# EasyEDA schematic 麦轮小车.json
TITLE: 麦轮小车; REV: 1.0; Date: 2022-09-26; Sheet: 1/1; Drawn By: Saw123; Company: Your Company
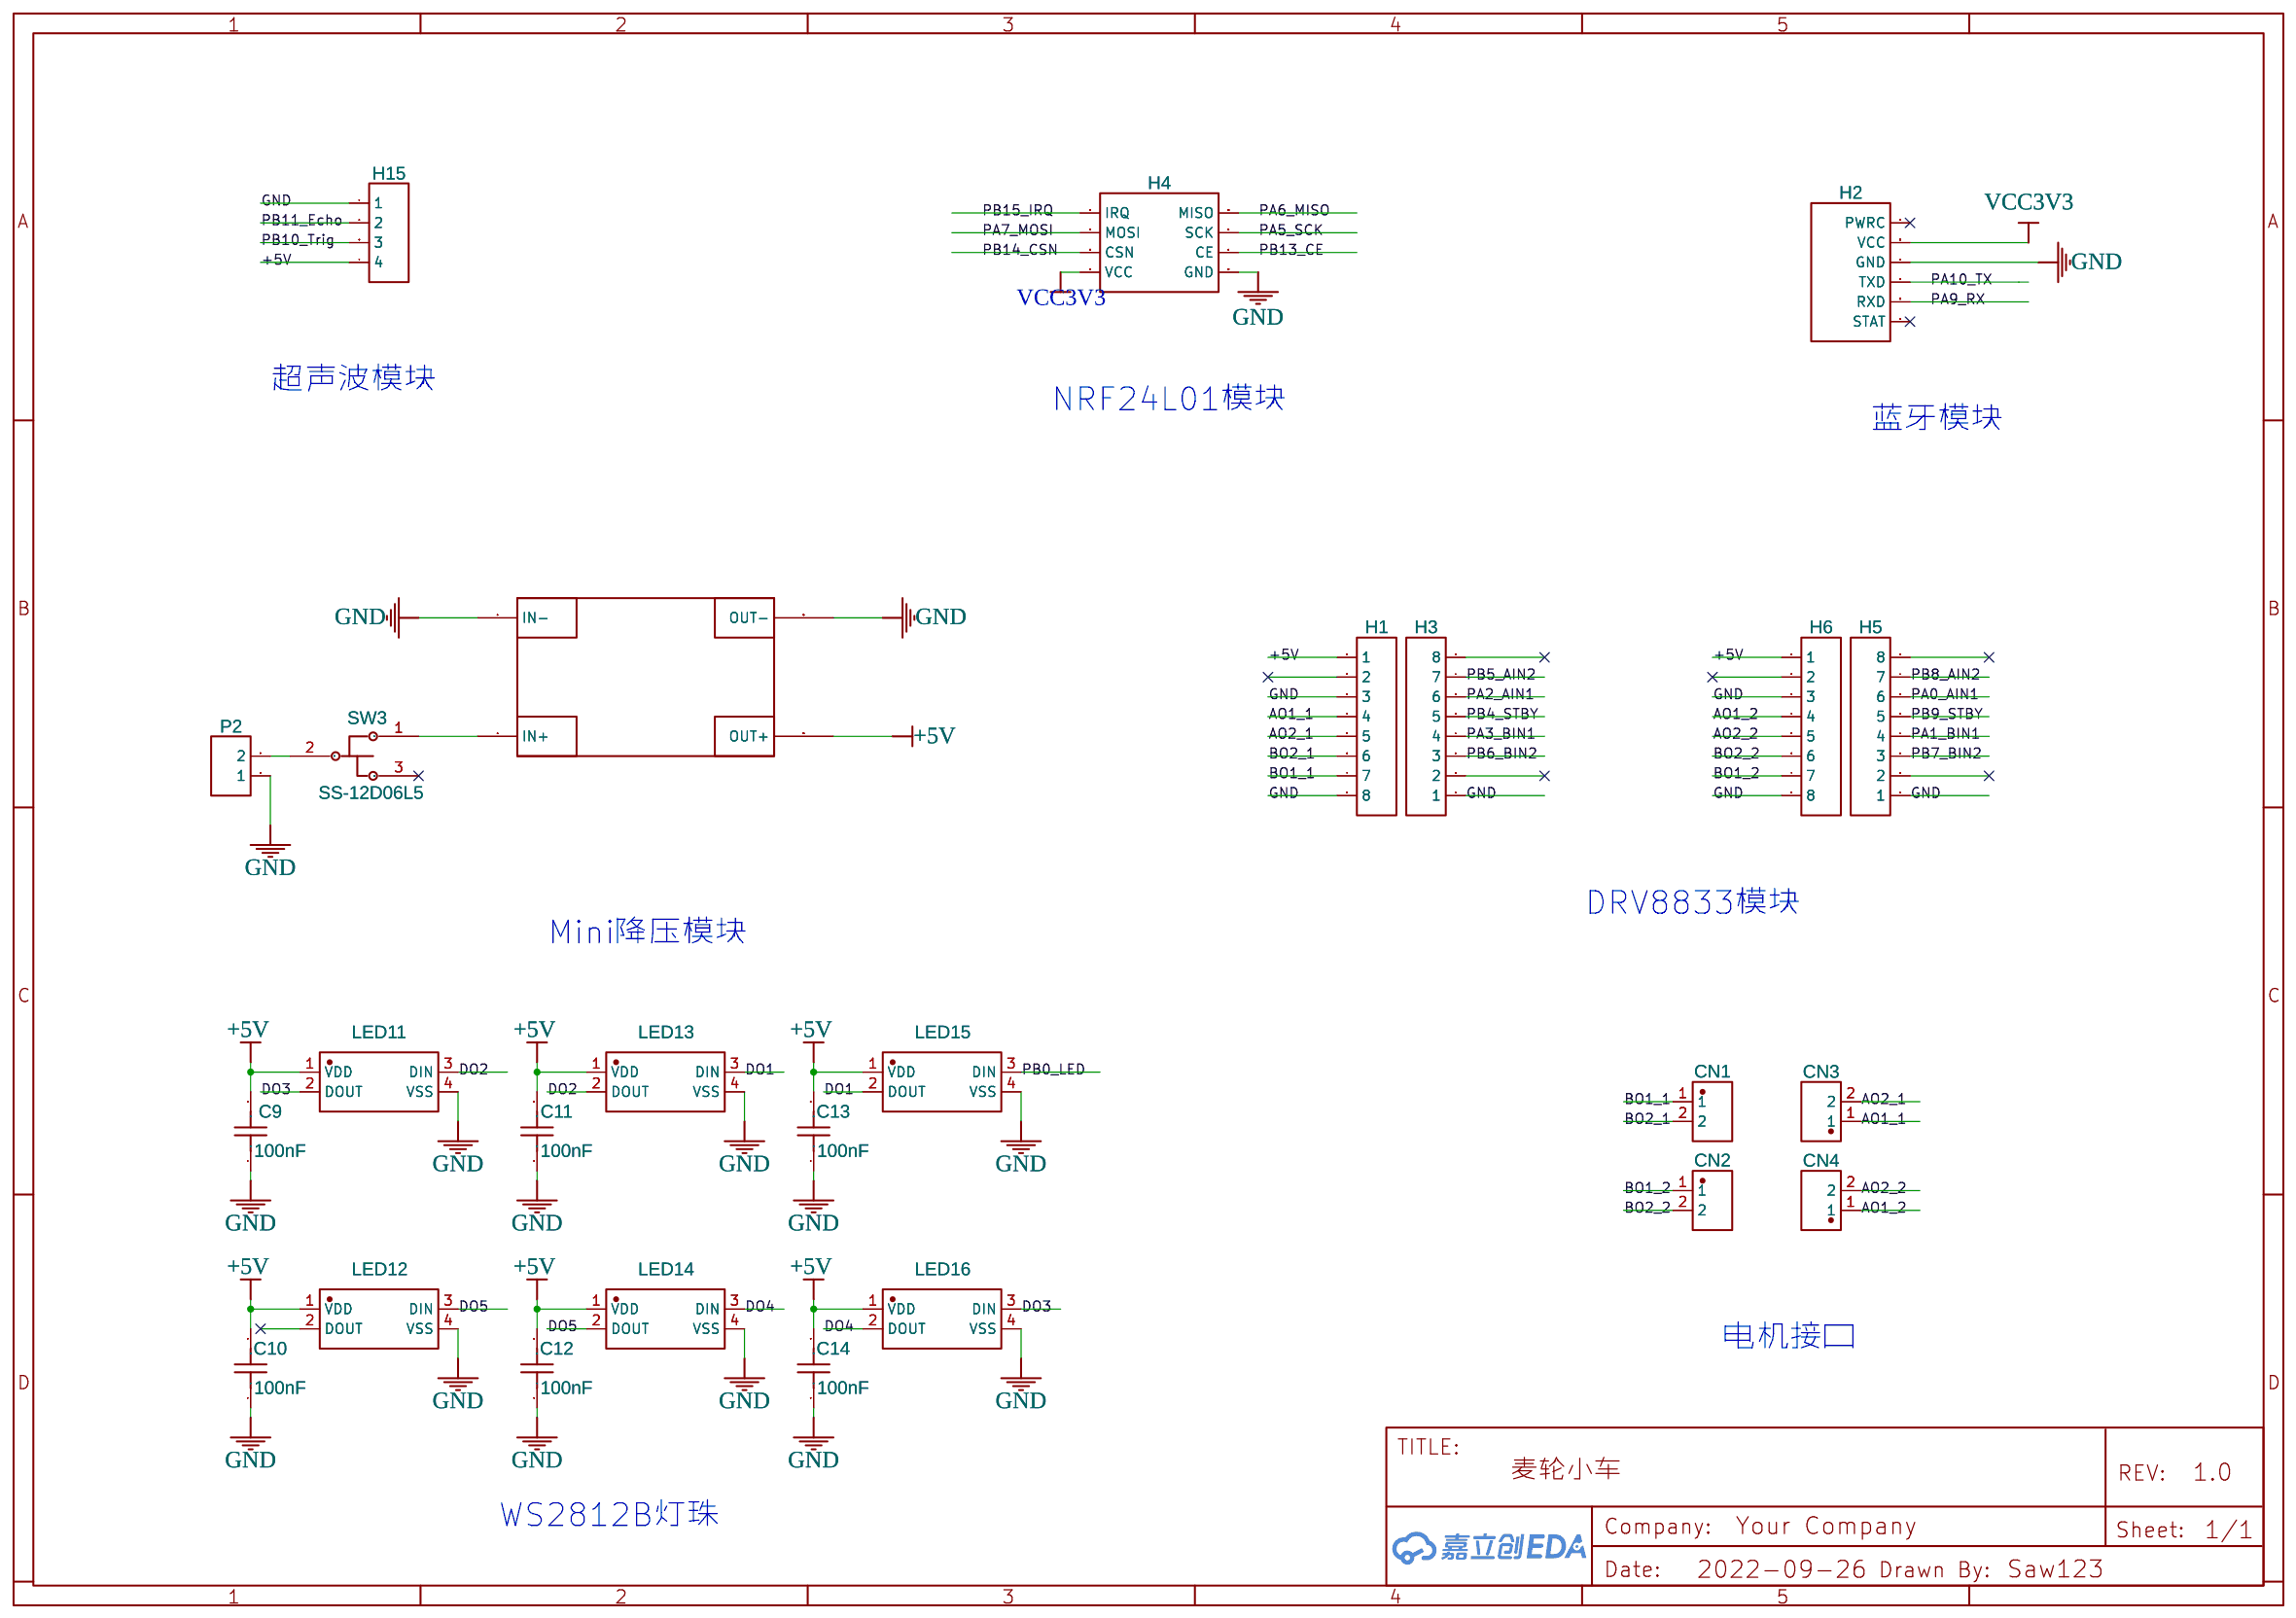
[diagram p0: schematic sheet]

## Parts
C9  100nF  [C0805]
C10  100nF  [C0805]
C11  100nF  [C0805]
C12  100nF  [C0805]
C13  100nF  [C0805]
C14  100nF  [C0805]
CN1  HX25035-2A  [CONN-TH_P2.50_HX25035-2A]
CN2  HX25035-2A  [CONN-TH_P2.50_HX25035-2A]
CN3  HX25035-2A  [CONN-TH_P2.50_HX25035-2A]
CN4  HX25035-2A  [CONN-TH_P2.50_HX25035-2A]
H1  HDR-F-2.54_1x8  [HDR-F-2.54_1X8]
H2  JDY-23蓝牙模块  [JDY-23蓝牙模块]
H3  HDR-F-2.54_1x8  [HDR-F-2.54_1X8]
H4  NRF24L01无线模块  [NRF24L01无线模块]
H5  HDR-F-2.54_1x8  [HDR-F-2.54_1X8]
H6  HDR-F-2.54_1x8  [HDR-F-2.54_1X8]
H15  HDR-F-2.54_1x4  [HDR-F-2.54_1X4]
LED11  WS2812B-V5/W  [LED-SMD_L5.0-W5.0-P3.20-LS5.4-TL]
LED12  WS2812B-V5/W  [LED-SMD_L5.0-W5.0-P3.20-LS5.4-TL]
LED13  WS2812B-V5/W  [LED-SMD_L5.0-W5.0-P3.20-LS5.4-TL]
LED14  WS2812B-V5/W  [LED-SMD_L5.0-W5.0-P3.20-LS5.4-TL]
LED15  WS2812B-V5/W  [LED-SMD_L5.0-W5.0-P3.20-LS5.4-TL]
LED16  WS2812B-V5/W  [LED-SMD_L5.0-W5.0-P3.20-LS5.4-TL]
P2  CONN-TH_2P-P5.00  [CONN-TH_2P-P5.00]
SW3  SS-12D06L5  [SS-12D06]
U2  Mini降压模块  [MINI降压模块]

## Library data of the parts
C9-C14 = C_0805_US: Contributor: LCEDA_Lib
CN1-CN4 = HX25035-2A: Supplier: LCSC; Supplier Part: C442378; Manufacturer: HX(红星); Contributor: LCSC; JLCPCB Part Class: Extended Part
H1 H3 H5 H6 = HDR-F-2.54_1x8: Supplier Part: C225505; Supplier: LCSC; Contributor: LCEDA_Lib
H2 = JDY-23蓝牙模块: Contributor: saw123
H4 = NRF24L01无线模块: Contributor: saw123
H15 = HDR-F-2.54_1x4: Supplier Part: C225501; Supplier: LCSC; Contributor: LCEDA_Lib
LED11-LED16 = WS2812B-V5/W: Supplier: LCSC; Supplier Part: C2874885; Manufacturer: worldsemi; JLCPCB Part Class: Extended Part; Contributor: lcsc
P2 = CONN-TH_2P-P5.00: Supplier: LCSC; Contributor: LCEDA_Lib
SW3 = SS-12D06L5: Supplier: LCSC; Supplier Part: C319015; Manufacturer: XKB Enterprise; Contributor: 酷电玩家
U2 = Mini降压模块: Contributor: Saw123

## Nets
+5V: C9.2 C10.2 C11.2 C12.2 C13.2 C14.2 H1.1 H6.1 H15.4 LED11.1(VDD) LED12.1(VDD) LED13.1(VDD) LED14.1(VDD) LED15.1(VDD) LED16.1(VDD) U2.OUT+
GND: C9.1 C10.1 C11.1 C12.1 C13.1 C14.1 H1.3 H1.8 H2.GND H3.1 H4.GND H5.1 H6.3 H6.8 H15.1 LED11.4(VSS) LED12.4(VSS) LED13.4(VSS) LED14.4(VSS) LED15.4(VSS) LED16.4(VSS) P2.1 U2.IN- U2.OUT-
VCC3V3: H2.VCC H4.VCC
AO1_1: CN3.1 H1.4
AO1_2: CN4.1 H6.4
AO2_1: CN3.2 H1.5
AO2_2: CN4.2 H6.5
BO1_1: CN1.1 H1.7
BO1_2: CN2.1 H6.7
BO2_1: CN1.2 H1.6
BO2_2: CN2.2 H6.6
DO1: LED13.3(DIN) LED15.2(DOUT)
DO2: LED11.3(DIN) LED13.2(DOUT)
DO3: LED11.2(DOUT) LED16.3(DIN)
DO4: LED14.3(DIN) LED16.2(DOUT)
DO5: LED12.3(DIN) LED14.2(DOUT)
PA0_AIN1: H5.6
PA1_BIN1: H5.4
PA2_AIN1: H3.6
PA3_BIN1: H3.4
PA5_SCK: H4.SCK
PA6_MISO: H4.MISO
PA7_MOSI: H4.MOSI
PA9_RX: H2.RXD
PA10_TX: H2.TXD
PB0_LED: LED15.3(DIN)
PB4_STBY: H3.5
PB5_AIN2: H3.7
PB6_BIN2: H3.3
PB7_BIN2: H5.3
PB8_AIN2: H5.7
PB9_STBY: H5.5
PB10_Trig: H15.3
PB11_Echo: H15.2
PB13_CE: H4.CE
PB14_CSN: H4.CSN
PB15_IRQ: H4.IRQ
Net-(P2-2): P2.2 SW3.2
Net-(SW3-1): SW3.1 U2.IN+

Not connected (* = marked no-connect by the designer): H1 2; H2 PWRC* STAT*; H3 2 8; H5 2 8; H6 2; LED12 2(DOUT); SW3 3*

## Notes on the sheet
- 超声波模块
- NRF24L01模块
- 蓝牙模块
- DRV8833模块
- Mini降压模块
- 电机接口
- WS2812B灯珠
